# Altium project 25E High Voltage Monitor Rev 2.PrjPcb
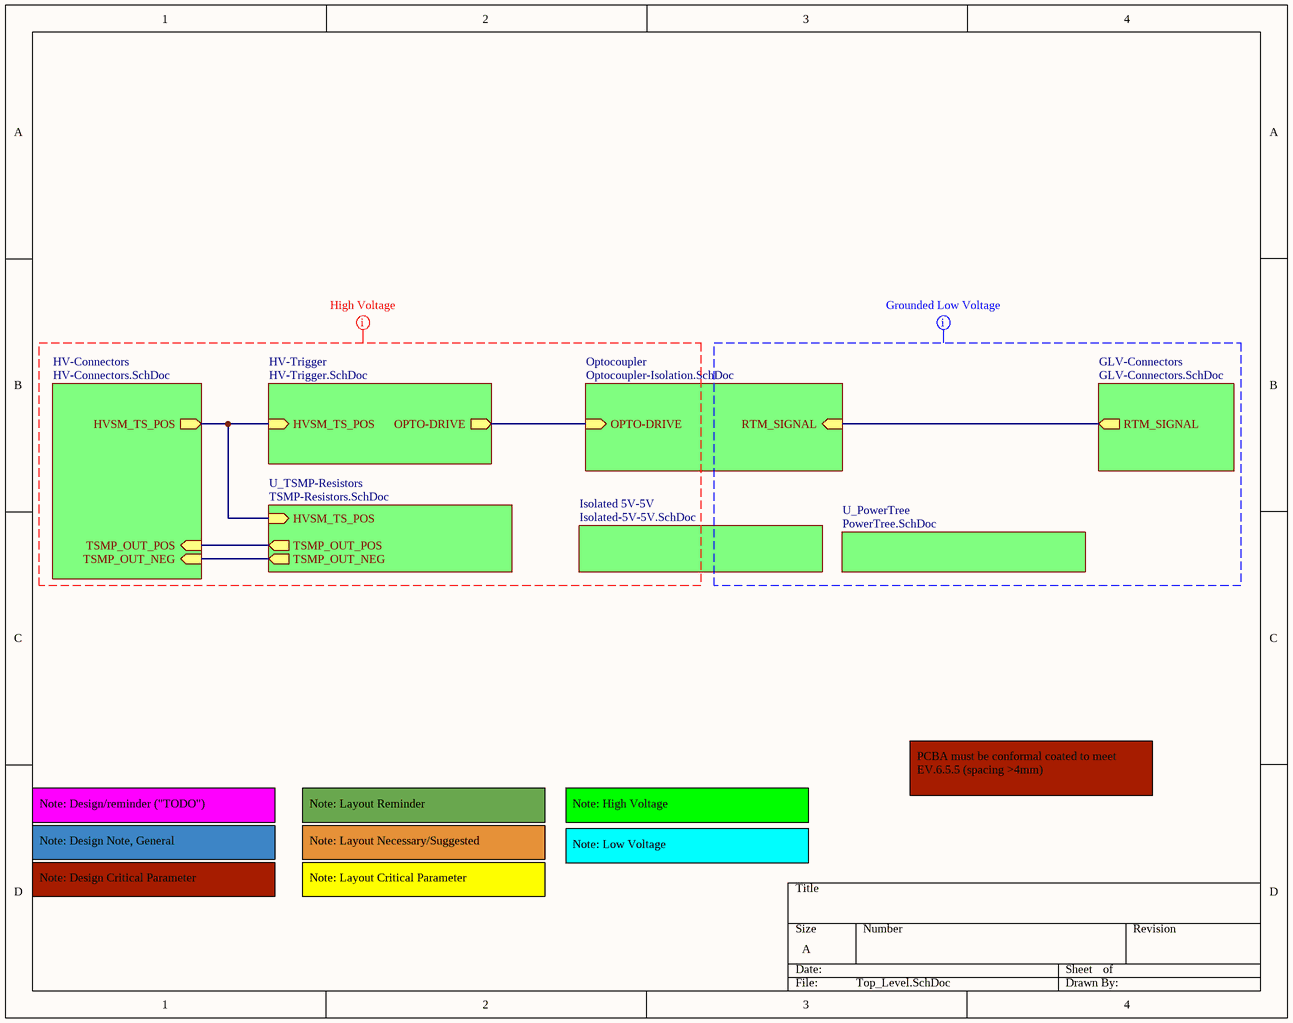
[diagram p0: Top_Level.SchDoc]
8 sheets, 59 parts. Net scope: hierarchical (ports join the sheet entries above them; power ports are global).
Board file: 25E_High_Voltage_Monitor_Rev2.PcbDoc
Sheets:
  Top_Level.SchDoc
    HV-Connectors = HV-Connectors.SchDoc
    HV-Trigger = HV-Trigger.SchDoc
    Isolated 5V-5V = Isolated-5V-5V.SchDoc
    Optocoupler = Optocoupler-Isolation.SchDoc
    U_PowerTree = PowerTree.SchDoc
    U_TSMP-Resistors = TSMP-Resistors.SchDoc
    GLV-Connectors = GLV-Connectors.SchDoc

## Sheet Top_Level.SchDoc
size A; SheetNumber: 1; SheetTotal: 8

### Sub-sheets
GLV-Connectors = GLV-Connectors.SchDoc: RTM_SIGNAL (out)
HV-Connectors = HV-Connectors.SchDoc: HVSM_TS_POS (out), TSMP_OUT_POS (in), TSMP_OUT_NEG (in)
HV-Trigger = HV-Trigger.SchDoc: HVSM_TS_POS (in), OPTO-DRIVE (out)
Isolated 5V-5V = Isolated-5V-5V.SchDoc: no entries
Optocoupler = Optocoupler-Isolation.SchDoc: RTM_SIGNAL (in), OPTO-DRIVE (in)
U_PowerTree = PowerTree.SchDoc: no entries
U_TSMP-Resistors = TSMP-Resistors.SchDoc: TSMP_OUT_POS (out), TSMP_OUT_NEG (out), HVSM_TS_POS (in)

### Nets
NetJ1_5: sheet Optocoupler/RTM_SIGNAL, sheet GLV-Connectors/RTM_SIGNAL
NetJ2_1: sheet HV-Connectors/HVSM_TS_POS, sheet HV-Trigger/HVSM_TS_POS, sheet U_TSMP-Resistors/HVSM_TS_POS
NetJ3_3: sheet HV-Connectors/TSMP_OUT_POS, sheet U_TSMP-Resistors/TSMP_OUT_POS
NetJ3_4: sheet HV-Connectors/TSMP_OUT_NEG, sheet U_TSMP-Resistors/TSMP_OUT_NEG
NetQ1_1: sheet HV-Trigger/OPTO-DRIVE, sheet Optocoupler/OPTO-DRIVE

### Layout directives
mark named High Voltage: (no net found under the mark)
mark named Grounded Low Voltage: (no net found under the mark)

### Notes on the sheet
- Note: Design/reminder ("TODO")
- Note: Layout Reminder
- Note: High Voltage
- PCBA must be conformal coated to meet EV.6.5.5 (spacing >4mm)
- Note: Design Note, General
- Note: Design Critical Parameter
- Note: Layout Necessary/Suggested
- Note: Layout Critical Parameter
- Note: Low Voltage

## Sheet HV-Connectors.SchDoc
size A; SheetNumber: 3; SheetTotal: 8
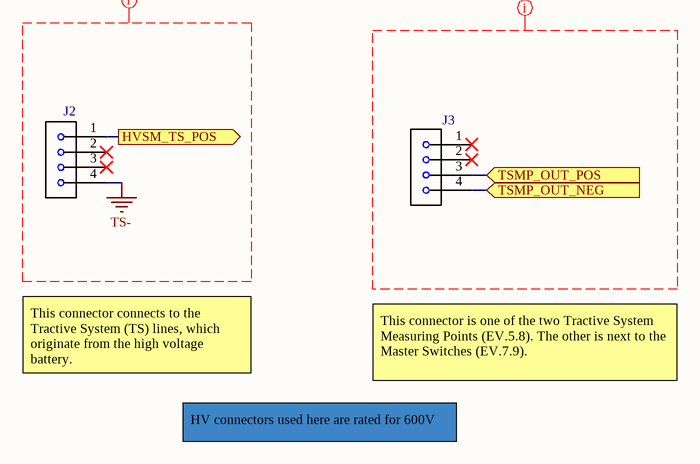
[diagram p1: HV-Connectors.SchDoc]

### Parts
J2  Conn-Molex-43045-0400  [FOOTPRINT-MOLEX-43045-0400]  (value not drawn)
J3  Conn-Molex-43045-0400  [FOOTPRINT-MOLEX-43045-0400]  (value not drawn)

### Ports
HVSM_TS_POS (out, see Top_Level[1B], HV-Trigger[1A], TSMP-Resistors[3B]), TSMP_OUT_NEG (in, see Top_Level[1C], TSMP-Resistors[2B]), TSMP_OUT_POS (in, see Top_Level[1C], TSMP-Resistors[2B])

### Nets
TS-: J2.4
NetJ2_1: J2.1 ; port HVSM_TS_POS
NetJ3_3: J3.3 ; port TSMP_OUT_POS
NetJ3_4: J3.4 ; port TSMP_OUT_NEG

Not connected (* = marked no-connect by the designer): J2 2* 3*; J3 1* 2*

### Layout directives
mark named TS Connections: TS-
mark named TSMP: (no net found under the mark)

### Notes on the sheet
- This connector connects to the Tractive System (TS) lines, which originate from the high voltage battery.
- This connector is one of the two Tractive System Measuring Points (EV.5.8). The other is next to the Master Switches (EV.7.9).
- HV connectors used here are rated for 600V

### Library data of the parts
J2 J3 = CMP-035-000005-2: Microfit RA 4ckt Std/Econ; MF: Molex; MP: 43045-0400; SnapEDA_Link: https://www.snapeda.com/parts/43045-0400/Molex/view-part/?ref=snap; Value: *; Price: None; Design Item ID: Conn-Molex-43045-0400; Package: None; Source: Connectors.SchLib; Availability: Unavailable

## Sheet HV-Trigger.SchDoc
size A; SheetNumber: 5; SheetTotal: 8
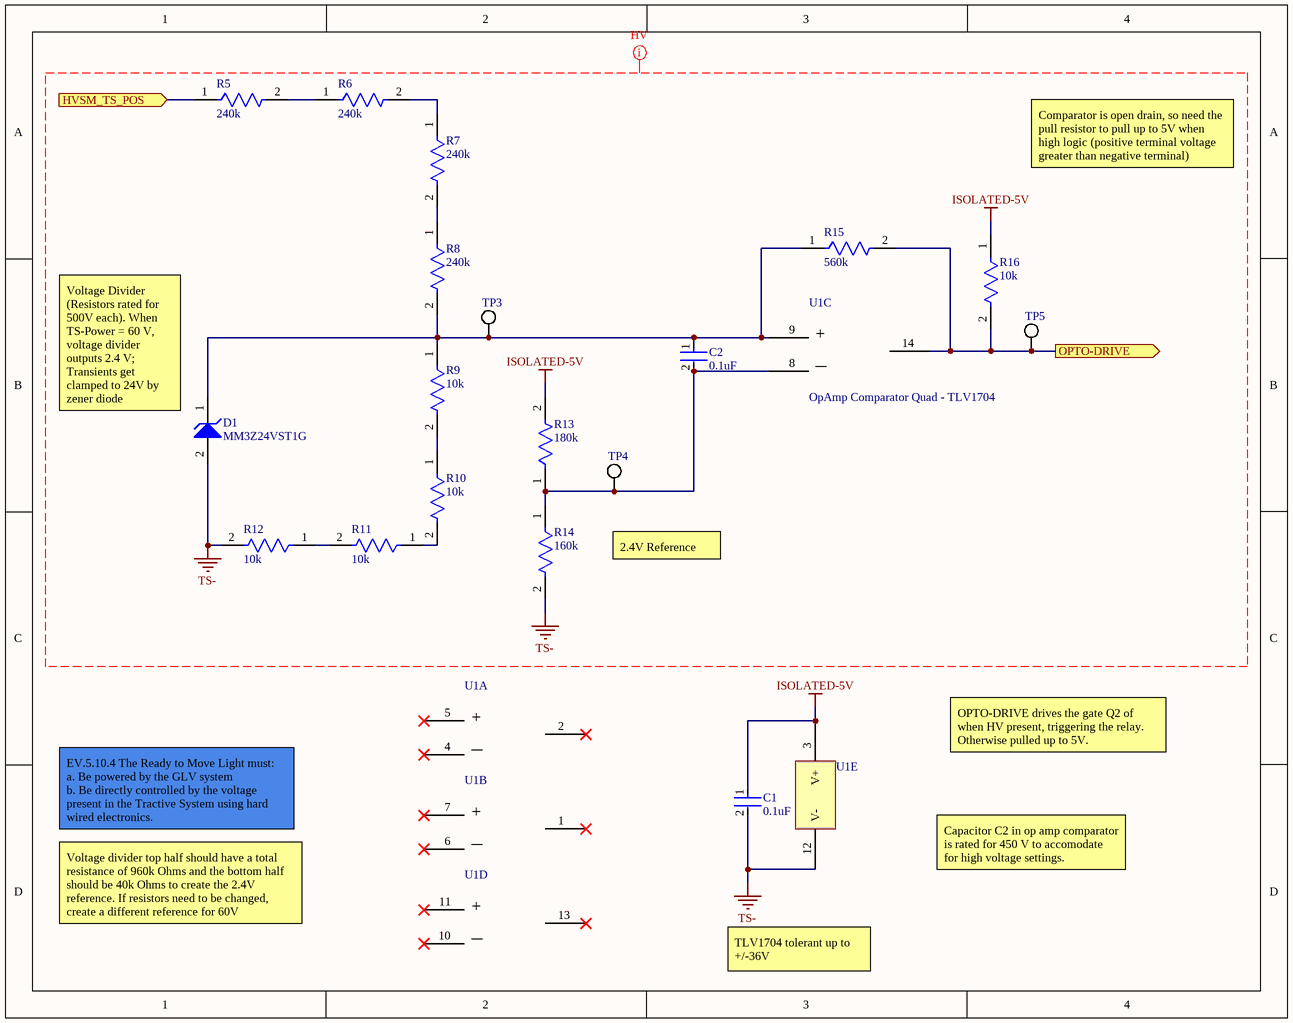
[diagram p2: HV-Trigger.SchDoc]

### Parts
C1  0.1uF  [FP-C1206C-EB-MFG]
C2  0.1uF  [FP-CGA5L-0_3-0_1-IPC_B]
D1  MM3Z24VST1G  [ONSC-SOD-323-2-477-02_V]
R5  240k  [FP-KTR18-IPC_A]
R6  240k  [FP-KTR18-IPC_A]
R7  240k  [FP-KTR18-IPC_A]
R8  240k  [FP-KTR18-IPC_A]
R9  10k  [FP-KTR18-MFG]
R10  10k  [FP-KTR18-MFG]
R11  10k  [FP-KTR18-MFG]
R12  10k  [FP-KTR18-MFG]
R13  180k  [FP-KTR18-MFG]
R14  160k  [FP-KTR18-IPC_C]
R15  560k  [FP-KTR18-IPC_C]
R16  10k  [FP-KTR18-MFG]
TP3  (no value)  [FOOTPRINT-GENERIC-TP-VIA-1MM]
TP4  (no value)  [FOOTPRINT-GENERIC-TP-VIA-1MM]
TP5  (no value)  [FOOTPRINT-GENERIC-TP-VIA-1MM]
U1  OpAmp Comparator Quad - TLV1704  [TSOP65P640X120-14N]  (value not drawn)  (parts A,B,C,D,E of 5)

### Ports
HVSM_TS_POS (in, see Top_Level[1B], HV-Connectors[2B], TSMP-Resistors[3B]), OPTO-DRIVE (out, see Top_Level[2B], Relay-Isolation[1C])

### Nets
ISOLATED-5V: C1.1 R13.2 R16.1 U1.3(V+)
TS-: C1.2 D1.2(A) R12.2 R14.2 U1.12(V-)
NetC2_1: C2.1 D1.1(K) R8.2 R9.1 R15.1 TP3.1(TP) U1.9(3IN+)
NetC2_2: C2.2 R13.1 R14.1 TP4.1(TP) U1.8(3IN-)
NetJ2_1: R5.1 ; port HVSM_TS_POS
NetQ1_1: R15.2 R16.2 TP5.1(TP) U1.14(3OUT) ; port OPTO-DRIVE
NetR5_2: R5.2 R6.1
NetR6_2: R6.2 R7.1
NetR7_2: R7.2 R8.1
NetR9_2: R9.2 R10.1
NetR10_2: R10.2 R11.1
NetR11_2: R11.2 R12.1

Not connected (* = marked no-connect by the designer): U1 1(2OUT)* 2(1OUT)* 4(1IN-)* 5(1IN+)* 6(2N-)* 7(2IN+)* 10(4IN-)* 11(4IN+)* 13(4OUT)*

### Layout directives
net class HV: ISOLATED-5V, TS-

### Notes on the sheet
- Comparator is open drain, so need the pull resistor to pull up to 5V when high logic (positive terminal voltage greater than negative terminal)
- (near D1) Voltage Divider (Resistors rated for 500V each). When TS-Power = 60 V, voltage divider outputs 2.4 V; Transients get clamped to 24V by zener diode
- 2.4V Reference
- OPTO-DRIVE drives the gate Q2 of when HV present, triggering the relay.
  Otherwise pulled up to 5V.
- EV.5.10.4 The Ready to Move Light must:
  a. Be powered by the GLV system
  b. Be directly controlled by the voltage present in the Tractive System using hard wired electronics.
- Capacitor C2 in op amp comparator is rated for 450 V to accomodate for high voltage settings.
- Voltage divider top half should have a total resistance of 960k Ohms and the bottom half should be 40k Ohms to create the 2.4V reference. If resistors need to be changed, create a different reference for 60V
- TLV1704 tolerant up to +/-36V
- (in symbol CMP-00000-2, part A) +; _
- (in symbol CMP-00000-2, part B) +; _
- (in symbol CMP-00000-2, part C) +; _
- (in symbol CMP-00000-2, part D) +; _

### Library data of the parts
C1 = CMP-1037-04229-2: CAP CER 0.1UF 250V X7R 1206; Manufacturer Part Number: C1206C104KARACTU; Manufacturer: KEMET; Material: Ceramic; Temperature Coefficient: 15%; Value: 0.10 μF; Tolerance: 0.1; Automotive Grade: Grade 0; Mouser Description: Multilayer Ceramic Capacitors MLCC - SMD/SMT 250volts 0.1uF X7R 10%; Height: 0.88mm; Device Class L3: Ceramic Capacitors; Temperature Range Low: -55°C; Automotive: Yes; ComponentLink2Description: Datasheet; Category: Cap; RoHS: TRUE; Temperature Range High: +150°C; Package: C1206C-EB; Device Class L2: Capacitors; Voltage Rating: 250 V; Lead Free: Yes; Temperature Characteristic: X7R; Digikey Description: CAP CER 0.1UF 250V X7R 1206; ComponentLink2URL: https://content.kemet.com/datasheets/KEM_C1007_X8R_ULTRA_150C_SMD.pdf; Device Class L1: Passive Components; Ipc Land Pattern Name: CAPC320160X78; Temperature: -55°C to +150°C; Capacitance: 0.10 μF; Octopart: https://octopart.com/c1206c104karactu-kemet-193627
C2 = CMP-08246-001673-1: Cap Ceramic 100nF 450V X7T 10% Pad SMD 1206 +125°C Automotive T/R; Min Operating Temperature: -55°C; Weight: 0.000571oz; Mount: Surface Mount; Depth: 1.6mm; Tolerance: 10%; Height: 1.6mm; Packaging: Tape and Reel; Ratings: AEC-Q200; Width: 0.063inch; Case Code (Imperial): 1206; Lead Free: Lead Free; Capacitance: 100nF; Termination: SMD/SMT; Features: Soft Termination; Thickness: 0.075inch; Package Quantity: 1; Case/Package: 1206; Length: 3.2mm; Max Operating Temperature: 125°C; Dielectric: X7T; REACH SVHC: No SVHC; Case Code (Metric): 3216; Voltage Rating: 450V; Voltage Rating (DC): 450V
D1 = CMP-1060-00674-1: Zener Voltage Regulator, 300 mW, 2-Pin SOD-323, Pb-Free, Tape and Reel; Manufacturer: On Semiconductor; PartNumber: MM3Z36VT1G; VZ Typ (V): 36; P Max (W): 0.3; ComponentLink2Description: Datasheet; ComponentLink3Description: Package Specification; ComponentLink1URL: http://www.onsemi.com/; RoHS: Pb-Free; PackageReference: SOD-323-2-477-02; Mounting Technology: Surface Mount; Packing: Tape and Reel; PackageDescription: 2-Pin SOD, Body 1.7 x 1.25 mm; ComponentLink1Description: Manufacturer URL; ComponentLink3URL: http://www.onsemi.com/pub_link/Collateral/477-02.PDF.1; DatasheetVersion: Rev. 9; PackageVersion: Rev. H, 03/2007; ComponentLink2URL: http://www.onsemi.cn/pub_link/Collateral/MM3Z2V4T1-D.PDF
R5-R8 = CMP-08839-030423-1: Res Thick Film 1206 240kΩ 1% 0.1W ±100ppm/°C Automotive Paper T/R; Resistance: 240kR; Max Power Dissipation: 250mW; Width: 0.063inch; Case/Package: 1206; Resistor Type: Thick Film; Package Quantity: 1; Case Code (Imperial): 1206; Tolerance: 1%; Height: 0.026inch; Case Code (Metric): 3216; Min Operating Temperature: -55°C; Number of Terminations: 2; Features: Automotive AEC-Q200; RoHS Compliant: Yes; Series: KTR; Packaging: Cut Tape; Temperature Coefficient: 100ppm/°C; Length: 0.126inch; Max Operating Temperature: 155°C
R9 R10 = CMP-08839-030597-1: Res Thick Film 1206 10kΩ 1% 0.1W ±100ppm/°C Automotive Paper T/R; Manufacturer: Rohm; Manufacturer Part Number: KTR18EZPF1002; Max Power Dissipation: 250mW; Resistance: 10kR; Rated Temperature: 70°C; Value: 10kR; Working Voltage: 500V; Temperature Coefficient (ppm/Cel): 100; Package Height: 0.55mm; Package Length: 3.2mm; Package Width: 1.6mm; Reference Standard: TS 16949; Temperature Coefficient: 100ppm/°C; Packaging: Tape and Reel; RoHS Compliant: Yes; Height: 0.026inch; Length: 0.126inch; Min Operating Temperature: -55°C; Case/Package: 1206; Features: Automotive AEC-Q200; Tolerance: 1%; Case Code (Metric): 3216; Series: KTR; Package Quantity: 1; Resistor Type: Thick Film; Width: 0.063inch; Max Operating Temperature: 155°C; Case Code (Imperial): 1206; Number of Terminations: 2; Supplier: Mouser; Supplier Part Number: 755-KTR18EZPF1002; RoHS: Yes; Category: Chip SMD Resistors; Stock: 9747; Pricing: 1=0.21, 10=0.105, 50=0.105, 100=0.062, 1000=0.038, 10000=0.03 (USD); Mounting Technology: Surface Mount; Pins: 2; Package Shape: Rectangular; Terminal Finish: Tin; Construction: Rectangular; Power: 250mW; Termination: Wraparound; JESD-609 Code: e3; Reach SVHC Compliant: Yes; ComponentLink1URL: https://datasheet.ciiva.com:443/pdfs/VipMasterIC/IC/ROHM/ROHM-S-A0008988694/ROHM-S-A0008988694-1.pdf?src-supplier=IHS+Markit; ComponentLink1Description: https://datasheet.ciiva.com:443/pdfs/VipMasterIC/IC/ROHM/ROHM-S-A0008988694/ROHM-S-A0008988694-1.pdf?src-supplier=IHS+Markit; ComponentLink2URL: https://datasheet.ciiva.com/2470/ktr-2470612.pdf?src-supplier=Digikey; ComponentLink2Description: https://datasheet.ciiva.com/2470/ktr-2470612.pdf?src-supplier=Digikey; ComponentLink3URL: https://datasheet.ciiva.com/2470/ktr-2470613.pdf?src-supplier=Digikey; ComponentLink3Description: https://datasheet.ciiva.com/2470/ktr-2470613.pdf?src-supplier=Digikey; ComponentLink4URL: https://datasheet.ciiva.com/2470/ktr-2470614.pdf?src-supplier=Digikey; ComponentLink4Description: https://datasheet.ciiva.com/2470/ktr-2470614.pdf?src-supplier=Digikey
R11 R12 R16 = CMP-08839-030597-1: Res Thick Film 1206 10kΩ 1% 0.1W ±100ppm/°C Automotive Paper T/R; Max Power Dissipation: 250mW; Resistance: 10kR; Temperature Coefficient: 100ppm/°C; Packaging: Tape and Reel; RoHS Compliant: Yes; Height: 0.026inch; Length: 0.126inch; Min Operating Temperature: -55°C; Case/Package: 1206; Features: Automotive AEC-Q200; Tolerance: 1%; Case Code (Metric): 3216; Series: KTR; Package Quantity: 1; Resistor Type: Thick Film; Width: 0.063inch; Max Operating Temperature: 155°C; Case Code (Imperial): 1206; Number of Terminations: 2
R13 = CMP-08839-001270-1: Res Thick Film 1206 180kΩ 1% 0.1W ±100ppm/°C Automotive Paper T/R; Resistance: 180kR; Max Power Dissipation: 250mW; RoHS Compliant: Yes; Series: KTR; Features: Automotive AEC-Q200; Tolerance: 1%; Case/Package: 1206; Packaging: Cut Tape; Height: 0.026inch; Case Code (Imperial): 1206; Min Operating Temperature: -55°C; Package Quantity: 5000; Case Code (Metric): 3216; Max Operating Temperature: 155°C; Width: 0.063inch; Length: 0.126inch; Temperature Coefficient: 100ppm/°C; Number of Terminations: 2; Resistor Type: Thick Film
R14 = CMP-08839-002259-1: Res Thick Film 1206 160kΩ 1% 0.1W ±100ppm/°C Automotive Paper T/R; Resistance: 160kR; Max Power Dissipation: 250mW; Package Quantity: 5000; Packaging: Cut Tape; Case Code (Metric): 3216; Temperature Coefficient: 100ppm/°C; Width: 0.063inch; Features: Automotive AEC-Q200; Tolerance: 1%; Resistor Type: Thick Film; Length: 0.126inch; Number of Terminations: 2; Max Operating Temperature: 155°C; Height: 0.026inch; Min Operating Temperature: -55°C; Case/Package: 1206; RoHS Compliant: Yes; Series: KTR; Case Code (Imperial): 1206
R15 = CMP-08839-031201-1: Res Thick Film 1206 560kΩ 1% 0.1W ±100ppm/°C Automotive Paper T/R; Max Power Dissipation: 250mW; Resistance: 560kR; Min Operating Temperature: -55°C; Series: KTR; Packaging: Tape and Reel; Resistor Type: Thick Film; Features: Automotive AEC-Q200; Tolerance: 1%; Max Operating Temperature: 155°C; RoHS Compliant: Yes; Case/Package: 1206; Temperature Coefficient: 100ppm/°C; Case Code (Metric): 3216; Case Code (Imperial): 1206; Number of Terminations: 2
TP3-TP5 = CMP-025-000000-1: Source: Generic.SchLib; Design Item ID: Misc-Generic-TP
U1 = CMP-00000-2: IC COMPARATOR QUAD 14TSSOP; Quiescent Current: 75uA; Output Current: 20mA; Max Input Current: 15nA; Number of Elements: 4; Propagation Delay: 560ns; Input Offset Voltage (Vos): 3.5mV; Min Operating Temperature: -40°C; Type: General Purpose; Packaging: Tape and Reel; Number of Pins: 14; Mount: Surface Mount; Input Bias Current: 15nA; RoHS Compliant: Yes; Case/Package: TSSOP; Lead Free: Lead Free; Number of Channels: 4; Max Operating Temperature: 125°C

## Sheet Isolated-5V-5V.SchDoc
size A; SheetNumber: 6; SheetTotal: 8
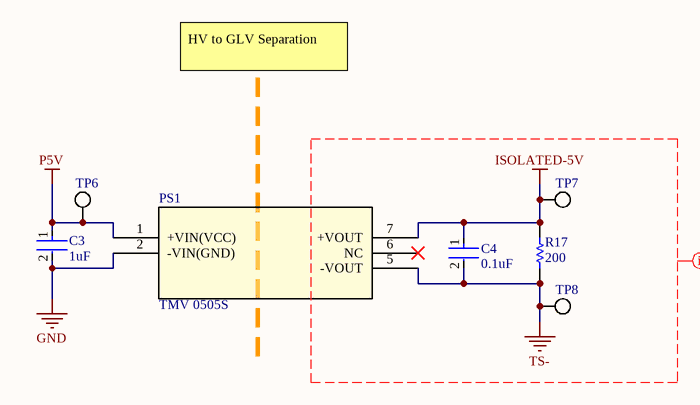
[diagram p3: Isolated-5V-5V.SchDoc]

### Parts
C3  1uF  [FP-C3216-160-0_2-IPC_B]
C4  0.1uF  [FP-C1206C-EB-MFG]
PS1  TMV 0505S  [TMV05-SINGLE_TRP]
R17  200  [RESC3216X70X50LL05T20]
TP6  (no value)  [FOOTPRINT-GENERIC-TP-VIA-1MM]
TP7  (no value)  [FOOTPRINT-GENERIC-TP-VIA-1MM]
TP8  (no value)  [FOOTPRINT-GENERIC-TP-VIA-1MM]

### Nets
GND: C3.2 PS1.2(-VIN(GND))
ISOLATED-5V: C4.1 PS1.7(+VOUT) R17.2 TP7.1(TP)
P5V: C3.1 PS1.1(+VIN(VCC)) TP6.1(TP)
TS-: C4.2 PS1.5(-VOUT) R17.1 TP8.1(TP)

Not connected (* = marked no-connect by the designer): PS1 6(NC)*

### Layout directives
net class HV: ISOLATED-5V, TS-

### Notes on the sheet
- HV to GLV Separation

### Library data of the parts
C3 = CMP-2000-05402-2: Multilayer Ceramic Capacitors 1uF ±10% 50V X7R SMD 1206; Voltage: 25V; Voltage Rating (DC): 50V; Dielectric: X7R; Number of Pins: 2; Length: 0.126inch; Case Code (Imperial): 1206; Capacitance: 1uF; Package Quantity: 2000; Min Operating Temperature: -55°C; Lead Free: Lead Free; Radiation Hardening: No; Termination: SMD/SMT; Case Code (Metric): 3216; Series: C; Weight: 0.000571oz; REACH SVHC: No SVHC; Tolerance: 10%; Max Operating Temperature: 125°C; RoHS Compliant: Yes; Mount: Surface Mount; Dielectric Material: Ceramic; Packaging: Tape and Reel; Thickness: 0.071inch; Height: 1.6mm; Resistor Type: Ceramic; Width: 0.063inch; Voltage Rating: 50V; Depth: 1.6mm; Case/Package: 1206
C4 = CMP-1037-04229-2: as C1 on sheet HV-Trigger; Mouser Description: Multilayer Ceramic Capacitors MLCC - SMD/SMT 250volts 0.1uF X7R 10%; Height: 0.88mm; Device Class L3: Ceramic Capacitors; Temperature Range Low: -55°C; Automotive: Yes; ComponentLink2Description: Datasheet; Category: Cap; RoHS: TRUE; Temperature Range High: +150°C; Package: C1206C-EB; Device Class L2: Capacitors; Voltage Rating: 250 V; Lead Free: Yes; Temperature Characteristic: X7R; Digikey Description: CAP CER 0.1UF 250V X7R 1206; ComponentLink2URL: https://content.kemet.com/datasheets/KEM_C1007_X8R_ULTRA_150C_SMD.pdf; Device Class L1: Passive Components; Ipc Land Pattern Name: CAPC320160X78; Temperature: -55°C to +150°C; Capacitance: 0.10 μF; Octopart: https://octopart.com/c1206c104karactu-kemet-193627
PS1 = CMP-053-000000-4: No Description Available; Vendor: Traco Power; SourceLibrary: Traco_Power_2020-05-29; Built_By: EMA_Justin; Copyright: Copyright (C) 2018 Accelerated Designs. All rights reserved; Source: 2021-05-26_16-57-50.SchLib; Datasheet: https://www.mouser.com/datasheet/2/687/tmv-519347.pdf; Design Item ID: TMV 0505S; Type: DEV; RefDes: RefDes; Manufacturer_Part_Number: TMV 0505S
R17 = CMP-2003-00194-1: Fixed Resistor, Metal Glaze/thick Film, 0.25W, 200ohm, 200V, 1% +/-Tol, 100ppm/Cel, Surface Mount, 1206; Part Number: ERJ-8ENF2000V; Manufacturer: Panasonic
TP6-TP8 = CMP-025-000000-1: Source: Generic.SchLib; Design Item ID: Misc-Generic-TP

## Sheet Optocoupler-Isolation.SchDoc
size A; SheetNumber: 7; SheetTotal: 8
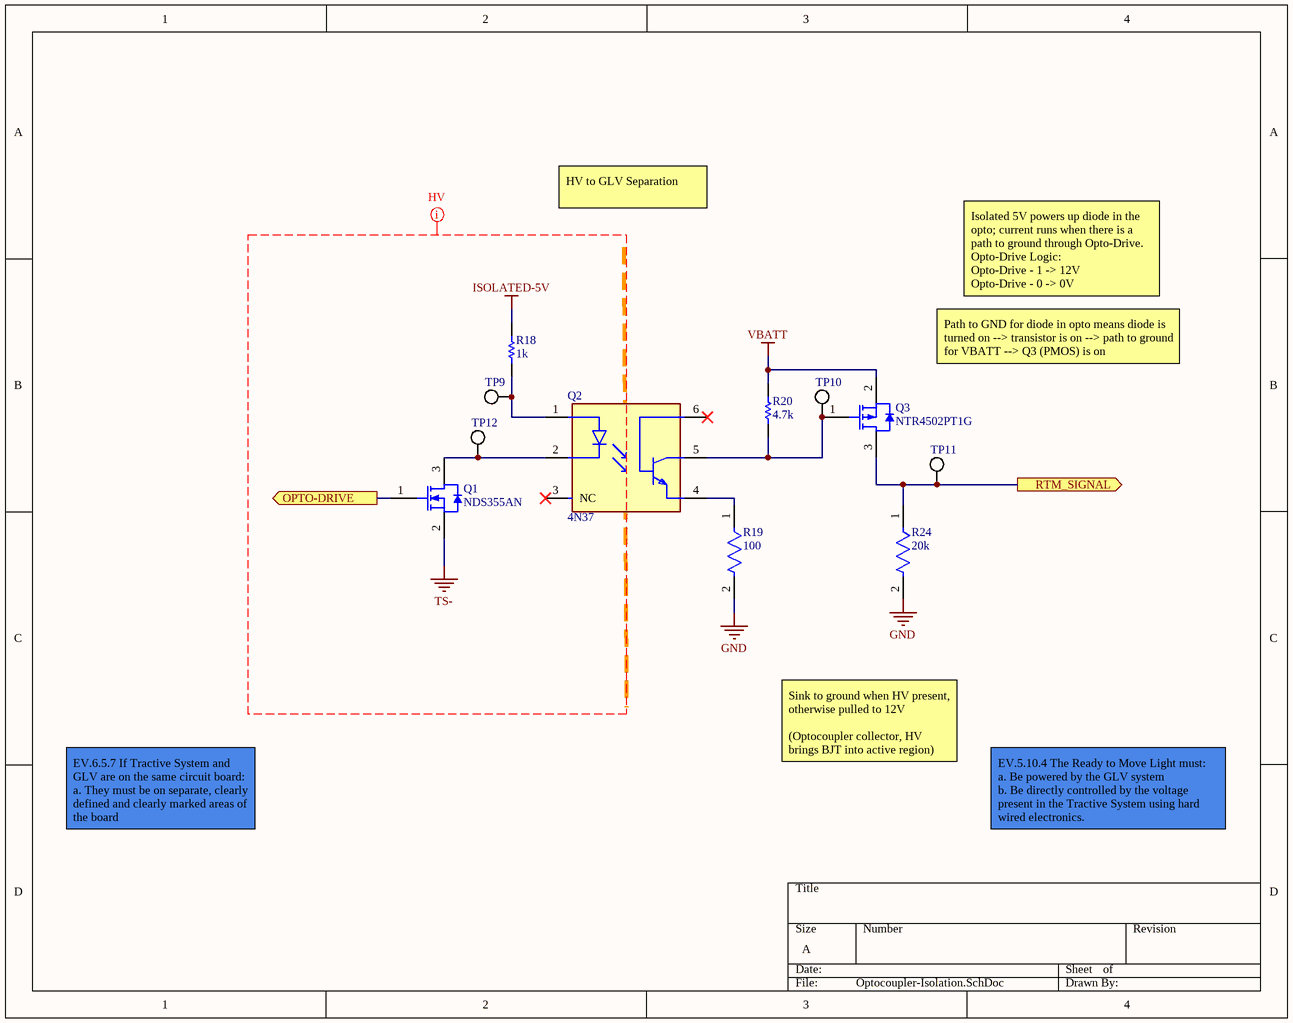
[diagram p4: Optocoupler-Isolation.SchDoc]

### Parts
Q1  NDS355AN  [FAIR-SOT-3_V]
Q2  4N37  [FP-4N37-MFG]
Q3  NTR4502PT1G  [ONSC-SOT-23-3-318-08_V]
R18  1k  [RESC3225X70X50NL20T20]
R19  100  [FP-CRCW1206-e3-MFG]
R20  4.7k  [RESC3216X60X45ML15T20]
R24  20k  [FP-CRCW1206-e3-MFG]
TP9  (no value)  [FOOTPRINT-GENERIC-TP-VIA-1MM]
TP10  (no value)  [FOOTPRINT-GENERIC-TP-VIA-1MM]
TP11  (no value)  [FOOTPRINT-GENERIC-TP-VIA-1MM]
TP12  (no value)  [FOOTPRINT-GENERIC-TP-VIA-1MM]

### Ports
OPTO-DRIVE (out, see Top_Level[2B], HV-Trigger[4B]), RTM_SIGNAL (out, see Top_Level[3B], GLV-Connectors[2B])

### Nets
GND: R19.2 R24.2
ISOLATED-5V: R18.1
TS-: Q1.2(S)
VBATT: Q3.2(S) R20.2
NetJ1_5: Q3.3(D) R24.1 TP11.1(TP) ; port RTM_SIGNAL
NetQ1_1: Q1.1(G) ; port OPTO-DRIVE
NetQ1_3: Q1.3(D) Q2.2(C) TP12.1(TP)
NetQ2_1: Q2.1(A) R18.2 TP9.1(TP)
NetQ2_4: Q2.4(E) R19.1
NetQ2_5: Q2.5(C) Q3.1(G) R20.1 TP10.1(TP)

Not connected (* = marked no-connect by the designer): Q2 3(NC)* 6(B)*

### Layout directives
mark named HV: ISOLATED-5V, TS-

### Notes on the sheet
- HV to GLV Separation
- Isolated 5V powers up diode in the opto; current runs when there is a path to ground through Opto-Drive. Opto-Drive Logic:                                       Opto-Drive - 1 -> 12V               Opto-Drive - 0 -> 0V
- Path to GND for diode in opto means diode is turned on --> transistor is on --> path to ground for VBATT --> Q3 (PMOS) is on
- Sink to ground when HV present, otherwise pulled to 12V
  (Optocoupler collector, HV brings BJT into active region)
- EV.6.5.7 If Tractive System and GLV are on the same circuit board:                       a. They must be on separate, clearly defined and clearly marked areas of the board
- EV.5.10.4 The Ready to Move Light must:
  a. Be powered by the GLV system
  b. Be directly controlled by the voltage present in the Tractive System using hard wired electronics.

### Library data of the parts
Q1 = CMP-2000-06834-1: N-Channel Logic Level Enhancement Mode Field Effect Transistor, 30 V, 1.7 A, -55 to150 degC, 3-Pin SOT-3, RoHS, Tape and Reel; Manufacturer: FairchildSemiconductor; Maximum Drain Source Voltage: 30V; RDS-on: 85@10VmOhm; Typical Fall Time: 5ns; Typical Rise Time: 32ns; Typical Turn-On Delay Time: 10ns; Channel Type: N; Typical Turn-Off Delay Time: 13ns; Maximum Gate Source Voltage: ±20V; Maximum Continuous Drain Current: 1.7A; Package URL: https://www.fairchildsemi.com/package-drawings/MA/MA03B.pdf; Packaging: Tape&Reel; Category: MOSFET; Mounting Technology: SurfaceMount; Datasheet Version: 01/1997; Datasheet URL: https://www.fairchildsemi.com/datasheets/ND/NDS355AN.pdf; Channel Mode: Enhancement; Package Description: 3-Pin Small Outline Transistor, Body 2.92 x 1.4 mm, Pitch 0.95 mm; Package: 3SuperSOT; Operating Temperature: -55to150°C; Package Reference: SOT-3; Manufacturer URL: https://www.fairchildsemi.com/; Mounting: SurfaceMount
Q2 = CMP-2000-05615-2: NexarPartId: 55433899; Collector Emitter Breakdown Voltage: 30V; Rise Time: 10µs; Approvals: BSI, FIMKO, UL; Reverse Breakdown Voltage: 6V; Voltage Rating (DC): 1.3V; Forward Voltage: 1.5V; Forward Current: 50mA; Isolation Voltage: 5kV; Max Power Dissipation: 70mW; Number of Channels: 1; Current Transfer Ratio: 50%; Max Collector Current: 100mA; Input Current: 10mA; Radiation Hardening: No; Case/Package: PDIP; Max Output Voltage: 30V; RoHS: Compliant; Output Voltage: 30V; REACH SVHC: Unknown; Lead Free: Lead Free; Max Input Current: 50mA; Mount: Through Hole; Max Operating Temperature: 100°C; Power Dissipation: 70mW; Collector Emitter Voltage (VCEO): 30V; Number of Elements: 1; Min Operating Temperature: -55°C; Fall Time: 10µs; Schedule B: 8541408000, 8541408000; Number of Pins: 6; Output Current per Channel: 50mA
Q3 = CMP-1058-00734-1: Power MOSFET, -30 V, -1.95 A, Single, P-Channel, 3-Pin SOT-23, Pb-Free, Tape and Reel; Manufacturer: On Semiconductor; VGS(th) Max (V): 3; Crss Typ (pF): 50; ID Max (A): 1.95; Ciss Typ (pF): 200; Coss Typ (pF): 80; Channel Polarity: P Channel; V(BR)DSS Min (V): 30; VGS Max (V): 20; PackageReference: SOT-23-3-318-08; Mounting Technology: Surface Mount; RoHS: Pb-Free; PartNumber: NTR4502PT1G; DatasheetVersion: Rev. 5; ComponentLink3URL: http://www.onsemi.cn/pub_link/Collateral/318-08.PDF; PackageDescription: 3-Pin Small Outline Transistor, Body 2.92 x 1.3 mm, Pitch 0.95 mm; ComponentLink1Description: Manufacturer URL; ComponentLink3Description: Package Specification; ComponentLink2Description: Datasheet; ComponentLink1URL: http://www.onsemi.com/; ComponentLink2URL: http://www.onsemi.cn/pub_link/Collateral/NTR4502P-D.PDF; Configuration: Single; PackageVersion: Rev. AP, 11/2009; Packing: Tape and Reel; Package Type: SOT-23-3
R18 = CMP-2005-01957-1: 360 Ohms ±1% 0.333W, 1/3W, FOOTPRINT-1210-GENERIC; Part Number: KTR25JZPF3600
R19 = CMP-2003-04801-2: RES Thick Film, 100Ω, 1%, 0.25W, 100ppm/°C, 1206; Voltage Rating (DC): 200V; Resistance: 100R; Power Rating: 250mW; Case Code (Metric): 3216; Radiation Hardening: No; Height: 0.55mm; Packaging: Tape and Reel; Depth: 1.6mm; Weight: 0.000353oz; Termination: SMD/SMT; Lead Free: Lead Free; Min Operating Temperature: -55°C; Contact Plating: Tin; Max Operating Temperature: 155°C; Case Code (Imperial): 1206; Military Standard: Not; Width: 1.6mm; Number of Pins: 2; Voltage Rating: 200V; Composition: Thick Film; Package Quantity: 5000; Tolerance: 1%; Case/Package: 1206; Mount: Surface Mount; Length: 3.2mm; Temperature Coefficient: 100ppm/°C
R20 = CMP-2100-03618-1: Chip Resistor, 4.7 KOhm, +/- 1%, 0.25 W, -55 to 155 degC, 1206 (3216 Metric), RoHS, Tape and Reel; Manufacturer: Vishay Semiconductor; Power Rating: 250mW; Voltage Rating: 200V; Temperature Coefficient: 100ppm/degreesC; Package Quantity: 10; Composition: ThickFilm; REACH SVHC: Unknown; Mount: SurfaceMount; Max Operating Temperature: 155degC; Length: 3.2mm; Number of Terminations: 2; Case Code (Metric): 3216; Military Standard: Not; Width: 1.6mm; Datasheet Version: 41061.0; Max Power Dissipation: 250mW; Datasheet URL: http://www.vishay.com/docs/20035/dcrcwe3.pdf; Contact Plating: Tin; Case/Package: 1206; Height: 0.55mm; Package Reference: 1206.0; Lead Free: LeadFree; Weight: 0.000353oz; Package Description: 2-Pin Surface Mount Device, Body 3.15 x 1.6 mm; Min Operating Temperature: -55degC; Resistance: 4.7KOhm; Packaging: TapeandReel; Depth: 1.6mm; Tolerance: 1%; RoHSCompliant: true; Termination: SMD/SMT; Case Code (Imperial): 1206; Voltage Rating (DC): 200V; Radiation Hardening: No; Manufacturer URL: http://www.vishay.com/
R24 = CMP-2003-01940-2: RES Thick Film, 20kΩ, 1%, 0.25W, 100ppm/°C, 1206; Power Rating: 250mW; Voltage Rating (DC): 200V; Resistance: 20kR; Length: 3.2mm; Case Code (Metric): 3216; Temperature Coefficient: 100ppm/°C; Height: 0.55mm; Max Power Dissipation: 250mW; Case/Package: 1206; Package Quantity: 10; Case Code (Imperial): 1206; Tolerance: 1%; Min Operating Temperature: -55°C; Width: 0.063inch; Max Operating Temperature: 155°C; Radiation Hardening: No; Composition: Thick Film; Lead Free: Lead Free; Military Standard: Not; Packaging: Tape and Reel; Voltage Rating: 200V; Depth: 1.6mm; Features: Automotive AEC-Q200; Weight: 0.000353oz; Working Voltage: 200V; Mount: Surface Mount; Contact Plating: Tin; Termination: SMD/SMT; Number of Pins: 2; Number of Terminations: 2
TP9-TP12 = CMP-025-000000-1: Source: Generic.SchLib; Design Item ID: Misc-Generic-TP

## Sheet PowerTree.SchDoc
size A; SheetNumber: 8; SheetTotal: 8
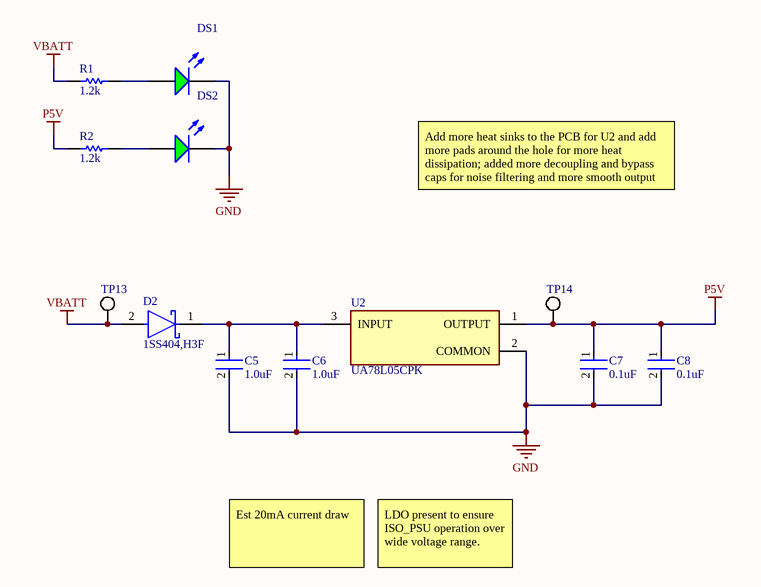
[diagram p5: PowerTree.SchDoc]

### Parts
C5  1.0uF  [FP-1206-L_3_2_0_2-W_1_6_0-IPC_A]
C6  1.0uF  [FP-1206-L_3_2_0_2-W_1_6_0-IPC_A]
C7  0.1uF  [FP-1206-L_3_2_0_2-W_1_6_0-IPC_C]
C8  0.1uF  [FP-1206-L_3_2_0_2-W_1_6_0-IPC_C]
D2  1SS404,H3F  [FP-SOD-323-MFG]
DS1  597-3311-407F  [DIAL-597-3311-407F_V]  (value not drawn)
DS2  597-3311-407F  [DIAL-597-3311-407F_V]  (value not drawn)
R1  1.2k  [RESC3216X70X50LL05T20]
R2  1.2k  [RESC3216X70X50LL05T20]
TP13  (no value)  [FOOTPRINT-GENERIC-TP-VIA-1MM]
TP14  (no value)  [FOOTPRINT-GENERIC-TP-VIA-1MM]
U2  UA78L05CPK  [FP-PK0003A-MFG]

### Nets
GND: C5.2 C6.2 C7.2 C8.2 DS1.2(K) DS2.2(K) U2.2(COMMON)
P5V: C7.1 C8.1 R2.1 TP14.1(TP) U2.1(OUTPUT)
VBATT: D2.2(A) R1.1 TP13.1(TP)
NetC5_1: C5.1 C6.1 D2.1(C) U2.3(INPUT)
NetDS1_1: DS1.1(A) R1.2
NetDS2_1: DS2.1(A) R2.2

### Notes on the sheet
- Add more heat sinks to the PCB for U2 and add more pads around the hole for more heat dissipation; added more decoupling and bypass caps for noise filtering and more smooth output
- Est 20mA current draw
- LDO present to ensure ISO_PSU operation over wide voltage range.

### Library data of the parts
C5 = CMP-2000-05866-2: General Purpose Ceramic Capacitor, 1206, 1uF, 10%, X7R, 15%, 50V; Manufacturer: Kyocera AVX; Manufacturer Part Number: 12065C105KAT2A; Dissipation Factor: 2.5%; Voltage: 25V; Multilayer: Yes; Dielectric: X7R; Radiation Hardening: No; Number of Pins: 2; Package Quantity: 1; Case Code (Metric): 3216; Thickness: 0.07inch; Voltage Rating (DC): 50V; Width: 0.063inch; Construction: Flat; Min Operating Temperature: -55°C; Length: 3.2mm; Voltage Rating: 50V; Case Code (Imperial): 1206; Height: 1.78mm; Capacitance: 1uF; REACH SVHC: No SVHC; Mount: Surface Mount; Max Operating Temperature: 125°C; Depth: 1.6mm; Packaging: Tape and Reel; Tolerance: 10%; Lead Free: Lead Free; Termination: SMD/SMT; RoHS Compliant: Yes; Case/Package: 1206; Contact Plating: Tin; Series: -; Supplier: Digikey; Supplier Part Number: 478-KGM31HR71H105KUCT-ND; RoHS: Yes; Category: Ceramic Capacitors; Stock: 33721; Pricing: 1=0.36, 10=0.212, 100=0.1385, 1000=0.10054, 2000=0.09094, 4000=0.08697, 6000=0.08446, 10000=0.08191, 14000=0.08036, 20000=0.07843, 50000=0.07526, 100000=0.07178 (USD); Mounting Technology: Surface Mount; Pins: 2; Dielectric Material: Ceramic; Package Shape: Rectangular; Terminal Finish: Nickel; Value: 1uF; Capacitor Type: Ceramic; Tolerance  (fill in as +-): 10%; Tolerance (fill in as +-): 10%; Rated DC Voltage (URdc): 50V; Temperature Characteristics Code: X7R; Package Style: SMTMeter; JESD-609 Code: e3; Reach SVHC Compliant: Yes; ComponentLink1URL: https://datasheet.ciiva.com:443/pdfs/VipMasterIC/IC/AVXC/AVXC-S-A0004824845/AVXC-S-A0004824845-1.pdf?src-supplier=IHS+Markit; ComponentLink1Description: https://datasheet.ciiva.com:443/pdfs/VipMasterIC/IC/AVXC/AVXC-S-A0004824845/AVXC-S-A0004824845-1.pdf?src-supplier=IHS+Markit
C6 = CMP-2000-05866-2: General Purpose Ceramic Capacitor, 1206, 1uF, 10%, X7R, 15%, 50V; Dissipation Factor: 2.5%; Voltage: 25V; Dielectric: X7R; Radiation Hardening: No; Number of Pins: 2; Package Quantity: 1; Case Code (Metric): 3216; Thickness: 0.07inch; Voltage Rating (DC): 50V; Width: 0.063inch; Construction: Flat; Min Operating Temperature: -55°C; Length: 3.2mm; Voltage Rating: 50V; Case Code (Imperial): 1206; Height: 1.78mm; Capacitance: 1uF; REACH SVHC: No SVHC; Mount: Surface Mount; Max Operating Temperature: 125°C; Depth: 1.6mm; Packaging: Tape and Reel; Tolerance: 10%; Lead Free: Lead Free; Termination: SMD/SMT; RoHS Compliant: Yes; Case/Package: 1206; Contact Plating: Tin; Series: -
C7 C8 = CMP-04427-013576-1: General Purpose Ceramic Capacitor, 1206, 100nF, 5%, X7R, 15%, 100V; Max Operating Temperature: 125°C; Depth: 1.6mm; Package Quantity: 1; Thickness: 0.05inch; Number of Pins: 2; Height: 1.27mm; Voltage Rating (DC): 100V; Radiation Hardening: No; Termination: SMD/SMT; Construction: Flat; REACH SVHC: No SVHC; Case/Package: 1206; Case Code (Imperial): 1206; Tolerance: 5%; Width: 0.063inch; Voltage: 100V; Packaging: Tape and Reel; Voltage Rating: 100V; Case Code (Metric): 3216; Capacitance: 100nF; Min Operating Temperature: -55°C; Length: 3.2mm; Dielectric: X7R; Mount: Surface Mount; Dielectric Material: Ceramic; Contact Plating: Tin; RoHS Compliant: Yes; Lead Free: Lead Free; Series: -
D2 = CMP-35905-000002-1: DIODE SCHOTTKY 20V 300MA USC; Max Repetitive Reverse Voltage (Vrrm): 25V; Element Configuration: Single; Mount: Surface Mount; Max Reverse Voltage (DC): 20V; Forward Current: 300mA; Packaging: Tape and Reel; Case/Package: SOD; Max Operating Temperature: 100°C; Min Operating Temperature: -40°C; Contact Plating: Tin; Average Rectified Current: 300mA
DS1 DS2 = CMP-007-00045-2: Single Color LED, Green, Water Clear, 2mm; Forward Voltage: 2.5V; Min Operating Temperature: -30°C; Max Operating Temperature: 85°C; Mounting Technology: Surface Mount; Pins: 2; RoHS Compliant: Yes
R1 R2 = CMP-2003-00061-1: Part Number: ERJ8ENF1201V; Manufacturer: Panasonic
TP13 TP14 = CMP-025-000000-1: Source: Generic.SchLib; Design Item ID: Misc-Generic-TP
U2 = CMP-2000-07341-2: IC REG LINEAR 5V 100MA SOT89-3; Manufacturer: Texas Instruments; Min Supply Voltage: 7V; Accuracy Percentage: 3.75%; Dropout Voltage: 1.7V; Number Of Outputs: 1; Nominal Supply Current: 3.8mA; Max Supply Voltage: 20V; Output Type: Fixed; Max Junction Temp: +125°C; Digikey Description: IC REG LINEAR 5V 100MA SOT89-3; RoHS: TRUE; ComponentLink2URL: https://www.ti.com/lit/ds/symlink/ua78l.pdf; Package: PK0003A; Temperature Range High: +125°C; Device Class L2: Power Management ICs; Manufacturer Part Number: UA78L05CPK; ComponentLink2Description: Datasheet; Category: IC; Lead Free: Yes; Automotive: No; Temperature Range Low: 0°C; Output Current: 100mA; Mouser Description: 100-mA, 30-V VIN, Positive-Voltage Linear Regulators 3-SOT-89 0 to 125; Device Class L3: Voltage Regulators - Linear; Device Class L1: Integrated Circuits (ICs); Temperature: 0°C to +125°C; Output Voltage: 5V; Height: 1.6mm; Octopart: https://octopart.com/ua78l05cpk-texas+instruments-525289

## Sheet TSMP-Resistors.SchDoc
size A; SheetNumber: 4; SheetTotal: 8
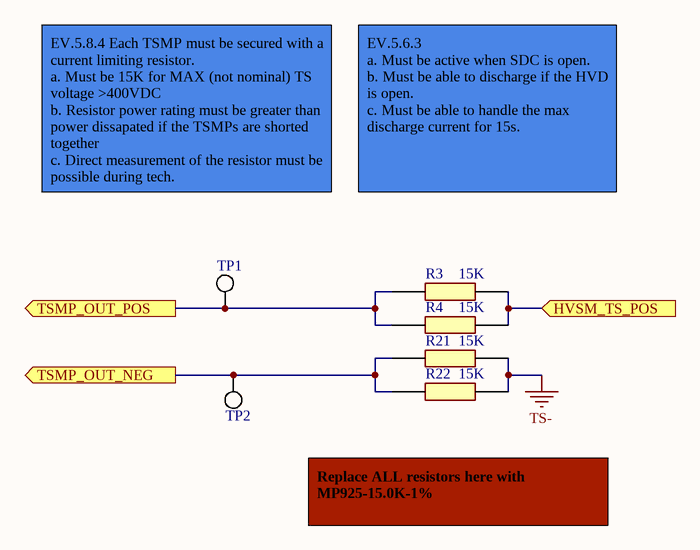
[diagram p6: TSMP-Resistors.SchDoc]

### Parts
R3  15K  [TO508P344X1041X2058-2P]
R4  15K  [TO508P344X1041X2058-2P]
R21  15K  [TO508P344X1041X2058-2P]
R22  15K  [TO508P344X1041X2058-2P]
TP1  (no value)  [FOOTPRINT-GENERIC-TP-VIA-1MM]
TP2  (no value)  [FOOTPRINT-GENERIC-TP-VIA-1MM]

### Ports
HVSM_TS_POS (in, see Top_Level[1C], HV-Connectors[2B], HV-Trigger[1A]), TSMP_OUT_NEG (out, see Top_Level[1C], HV-Connectors[3B]), TSMP_OUT_POS (out, see Top_Level[1C], HV-Connectors[3B])

### Nets
TS-: R21.2 R22.2
NetJ2_1: R3.2 R4.2 ; port HVSM_TS_POS
NetJ3_3: R3.1 R4.1 TP1.1(TP) ; port TSMP_OUT_POS
NetJ3_4: R21.1 R22.1 TP2.1(TP) ; port TSMP_OUT_NEG

### Notes on the sheet
- EV.5.8.4 Each TSMP must be secured with a current limiting resistor.
  a. Must be 15K for MAX (not nominal) TS voltage >400VDC
  b. Resistor power rating must be greater than power dissapated if the TSMPs are shorted together
  c. Direct measurement of the resistor must be possible during tech.
- EV.5.6.3
  a. Must be active when SDC is open.
  b. Must be able to discharge if the HVD is open.
  c. Must be able to handle the max discharge current for 15s.
- Replace ALL resistors here with MP925-15.0K-1%

### Library data of the parts
R3 R4 R21 R22 = MP925-15.0K-1%: Thick Film Resistors - Through Hole 15K ohm 25W 1% TO-220 PKG PWR FILM; Manufacturer_Name: Caddock; Geometry.Height: 3.44mm; Mouser Part Number: 684-MP925-15K; Mouser Price/Stock: https://www.mouser.co.uk/ProductDetail/Caddock/MP925-15.0K-1?qs=3xGhc7tteJWFgUsHgFGqHw%3D%3D; Manufacturer_Part_Number: MP925-15.0K-1%; Datasheet Link: http://www.caddock.com/Online_catalog/Mrktg_Lit/MP9000_Series.pdf; Supplier 1: Digikey; Supplier Part Number 1: MP925-15.0KF-ND
TP1 TP2 = CMP-025-000000-1: Source: Generic.SchLib; Design Item ID: Misc-Generic-TP

## Sheet GLV-Connectors.SchDoc
size A; SheetNumber: 2; SheetTotal: 8
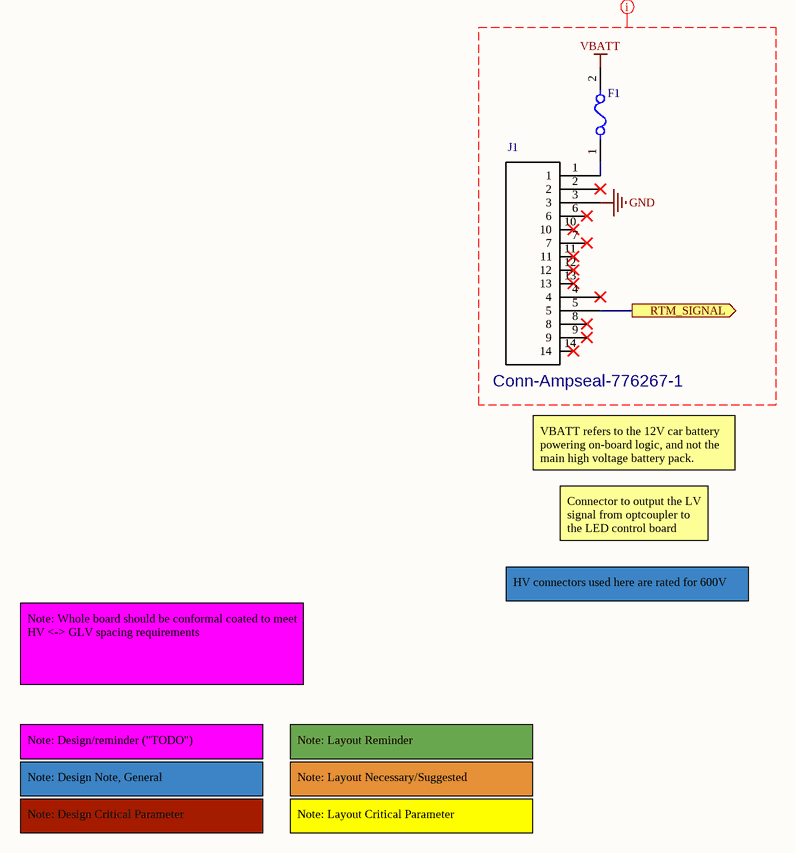
[diagram p7: GLV-Connectors.SchDoc]

### Parts
F1  0468003.NRHF  [FP-437-MFG]  (value not drawn)
J1  Conn-Ampseal-776267-1  [FOOTPRINT-AMPSEAL-776267-1]

### Ports
RTM_SIGNAL (out, see Top_Level[4B], Relay-Isolation[4B])

### Nets
GND: J1.3
VBATT: F1.2
NetF1_1: F1.1 J1.1
NetJ1_5: J1.5 ; port RTM_SIGNAL

Not connected (* = marked no-connect by the designer): J1 2* 4* 6* 7* 8* 9* 10* 11* 12* 13* 14*

### Layout directives
mark named GLV plus LV RTML Connection: GND, VBATT

### Notes on the sheet
- VBATT refers to the 12V car battery powering on-board logic, and not the main high voltage battery pack.
- Connector to output the LV signal from optcoupler to the LED control board
- HV connectors used here are rated for 600V
- Note: Whole board should be conformal coated to meet HV <-> GLV spacing requirements
- Note: Design/reminder ("TODO")
- Note: Layout Reminder
- Note: Design Note, General
- Note: Layout Necessary/Suggested
- Note: Design Critical Parameter
- Note: Layout Critical Parameter

### Library data of the parts
F1 = CMP-08605-000049-1: FUSE BRD MNT 3A 32VAC 35VDC 1206; Manufacturer: Littelfuse Inc; Manufacturer Part Number: 0437003.WR; Fuse Interrupt Ac Current: 50A; Value: 0.033Ω; Fuse Blow Speed: Fast; Voltage Rating: 32V; Max Fuse Dc Voltage: 35V; Fuse I2T: 0.506A2Sec; Fuse Voltage Drop: 0.14V; Octopart: https://octopart.com/0437003.wr-littelfuse-8600121; Category: Fuse; Fuse Interrupt Dc Current: 50A; Temperature: -55°C to +150°C; Device Class L1: Circuit Protection; Fuse Current: 3A; Temperature Range High: +150°C; Temperature Range Low: -55°C; Resistance: 0.033Ω; Automotive: No; ComponentLink2URL: https://www.littelfuse.com/~/media/electronics/datasheets/fuses/littelfuse_fuse_437_datasheet.pdf.pdf; Ipc Land Pattern Name: CAPC320163X82; Mouser Description: Surface Mount Fuses 32V FA 1206 3A; Device Class L2: Fuses; Device Class L3: unset; Package: 437; RoHS: TRUE; Height: 0.8639mm; Digikey Description: FUSE BRD MNT 3A 32VAC 35VDC 1206; ComponentLink2Description: Datasheet; Lead Free: Yes; Max Fuse Ac Voltage: 32V
J1 = CMP-035-000002-1: AMPSEAL RA 14ckt Faced w/ Gasket Automotive; MF: TE Connectivity; Source: Connectors.SchLib; SnapEDA_Link: https://www.snapeda.com/parts/776267-1/TE%20Connectivity%20AMP%20Connectors/view-part/?ref=snap; Value: *; MP: 776267-1; Package: None; Availability: Unavailable; Price: None; Design Item ID: Conn-Ampseal-776267-1; TE_purchase_URL: https://www.te.com/usa-en/product-776267-1.html?te_bu=Cor&te_type=disp&te_campaign=seda_glo_cor-seda-global-disp-prtnr-fy19-seda-model-bom-cta_sma-317_1&elqCampaignId=32493; EU_RoHS_Compliance: Compliant

## Nets that join several sheets
GND: Isolated-5V-5V (C3.2 PS1.2), Optocoupler-Isolation (R19.2 R24.2), PowerTree (7 pins), GLV-Connectors (J1.3)
ISOLATED-5V: HV-Trigger (C1.1 R13.2 R16.1 U1.3), Isolated-5V-5V (C4.1 PS1.7 R17.2 TP7.1), Optocoupler-Isolation (R18.1)
P5V: Isolated-5V-5V (C3.1 PS1.1 TP6.1), PowerTree (5 pins)
TS-: HV-Connectors (J2.4), HV-Trigger (5 pins), Isolated-5V-5V (C4.2 PS1.5 R17.1 TP8.1), Optocoupler-Isolation (Q1.2), TSMP-Resistors (R21.2 R22.2)
VBATT: Optocoupler-Isolation (Q3.2 R20.2), PowerTree (D2.2 R1.1 TP13.1), GLV-Connectors (F1.2)
NetJ1_5: Optocoupler-Isolation (Q3.3 R24.1 TP11.1), GLV-Connectors (J1.5)
NetJ2_1: HV-Connectors (J2.1), HV-Trigger (R5.1), TSMP-Resistors (R3.2 R4.2)
NetJ3_3: HV-Connectors (J3.3), TSMP-Resistors (R3.1 R4.1 TP1.1)
NetJ3_4: HV-Connectors (J3.4), TSMP-Resistors (R21.1 R22.1 TP2.1)
NetQ1_1: HV-Trigger (R15.2 R16.2 TP5.1 U1.14), Optocoupler-Isolation (Q1.1)